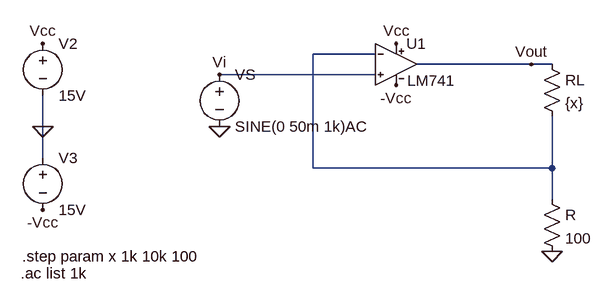
[diagram p0: schematic VCCS.asc]
VCCS.asc, the LTspice schematic file:
Version 4
SHEET 1 1020 680
WIRE 416 96 320 96
WIRE 656 112 480 112
WIRE 688 112 656 112
WIRE 416 128 176 128
WIRE -96 208 -96 160
WIRE -96 256 -96 208
WIRE 320 272 320 96
WIRE 688 272 688 192
WIRE 688 272 320 272
WIRE 688 320 688 272
FLAG -96 208 0
FLAG 176 208 0
FLAG 688 400 0
FLAG -96 80 Vcc
FLAG 448 80 Vcc
FLAG -96 336 -Vcc
FLAG 448 144 -Vcc
FLAG 656 112 Vout
FLAG 176 128 Vi
SYMBOL LM741 448 48 R0
SYMATTR InstName U1
SYMBOL voltage -96 64 R0
SYMATTR InstName V2
SYMATTR Value 15V
SYMBOL voltage -96 240 R0
SYMATTR InstName V3
SYMATTR Value 15V
SYMBOL res 672 96 R0
SYMATTR InstName RL
SYMATTR Value {x}
SYMBOL res 672 304 R0
SYMATTR InstName R
SYMATTR Value 100
SYMBOL voltage 176 112 R0
WINDOW 123 24 124 Left 2
WINDOW 39 0 0 Left 2
SYMATTR InstName VS
SYMATTR Value SINE(0 50m 1k)AC
TEXT -130 434 Left 2 !.ac list 1k
TEXT -128 408 Left 2 !.step param x 1k 10k 100

The netlist it stands for:
* VCCS.asc
XU1 Vi N001 Vcc -Vcc Vout LM741  ; pins In+ In- V+ V- OUT
V2 Vcc 0 15V
V3 0 -Vcc 15V
RL Vout N001 {x}
R N001 0 100
VS Vi 0 SINE(0 50m 1k)AC
.ac list 1k
.step param x 1k 10k 100
.lib LM741.lib
.backanno
.end